# EAGLE design LoRareceiver (EAGLE 9.6.2)
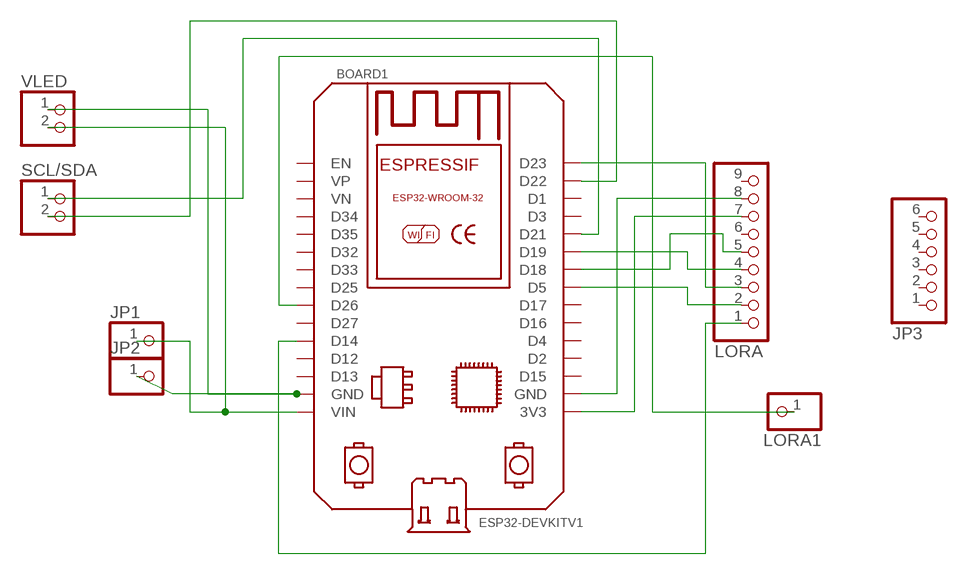
[diagram p0: schematic, sheet 1]

## Parts
BOARD1  ESP32DEVKITV1  [ESP32-DEVKITV1]
JP1  PINHD-1X1  [1X01]
JP2  PINHD-1X1  [1X01]
JP3  PINHD-1X6  [1X06]
LORA  PINHD-1X9  [1X09-BIG]
LORA1  PINHD-1X1  [1X01]
SCL/SDA  PINHD-1X2  [1X02]
VLED  PINHD-1X2  [1X02]

## Nets
N$1: BOARD1.D14 LORA.1
N$2: BOARD1.D5 LORA.2
N$3: BOARD1.D23 LORA.3
N$4: BOARD1.D19 LORA.4
N$5: BOARD1.D18 LORA.5
N$6: BOARD1.D26 LORA1.1
N$7: BOARD1.3V3 LORA.7
N$8: BOARD1.GND@1(GND) LORA.8
N$9: BOARD1.VIN JP1.1 VLED.2
N$10: BOARD1.GND JP2.1 VLED.1
N$12: BOARD1.D22 SCL/SDA.2
N$13: BOARD1.D21 SCL/SDA.1
Unconnected: BOARD1.D1 BOARD1.D2 BOARD1.D3 BOARD1.D4 BOARD1.D12 BOARD1.D13 BOARD1.D15 BOARD1.D16 BOARD1.D17 BOARD1.D25 BOARD1.D27 BOARD1.D32 BOARD1.D33 BOARD1.D34 BOARD1.D35 BOARD1.EN BOARD1.VN BOARD1.VP JP3.1 JP3.2 JP3.3 JP3.4 JP3.5 JP3.6 LORA.6 LORA.9

## Library data of the parts
BOARD1 = ESP32-DEVKITV1:ESP32DEVKITV1: https://github.com/shridattdudhat
JP1 JP2 LORA1 = adafruit:PINHD-1X1: Pin header 1x1 for 0.1" spacing With round pins
JP3 = adafruit:PINHD-1X6: PIN HEADER
LORA = adafruit:PINHD-1X9: Pin header 1x10 0.1" spacing With round pins
SCL/SDA VLED = pinhead:PINHD-1X2: PIN HEADER

## Board
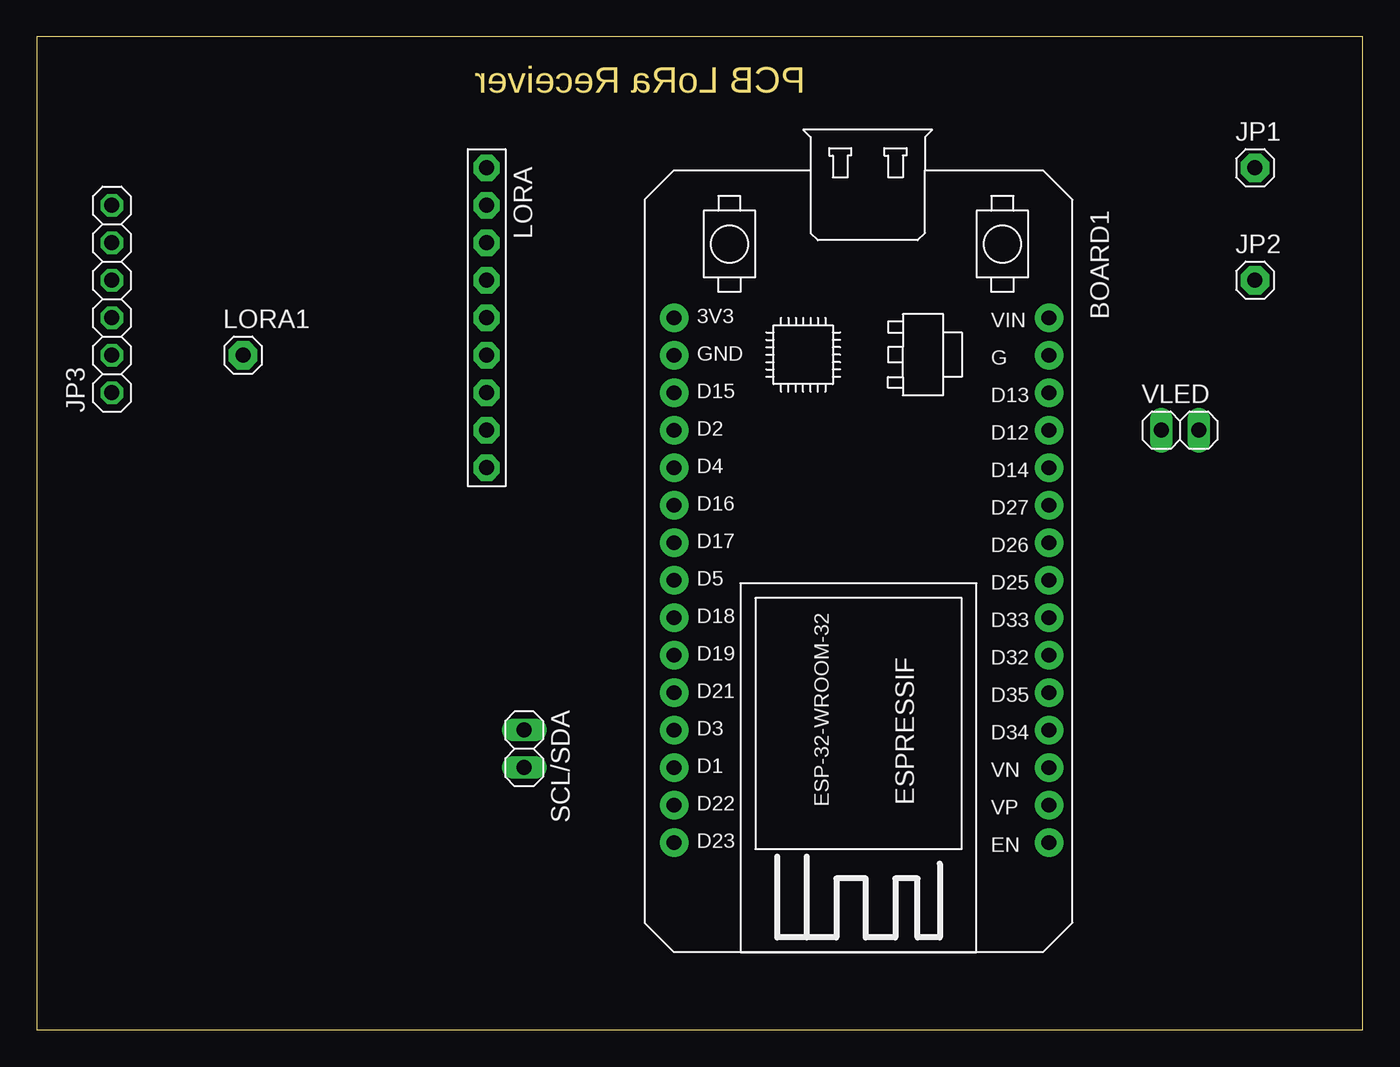
[diagram p1: board, top side]
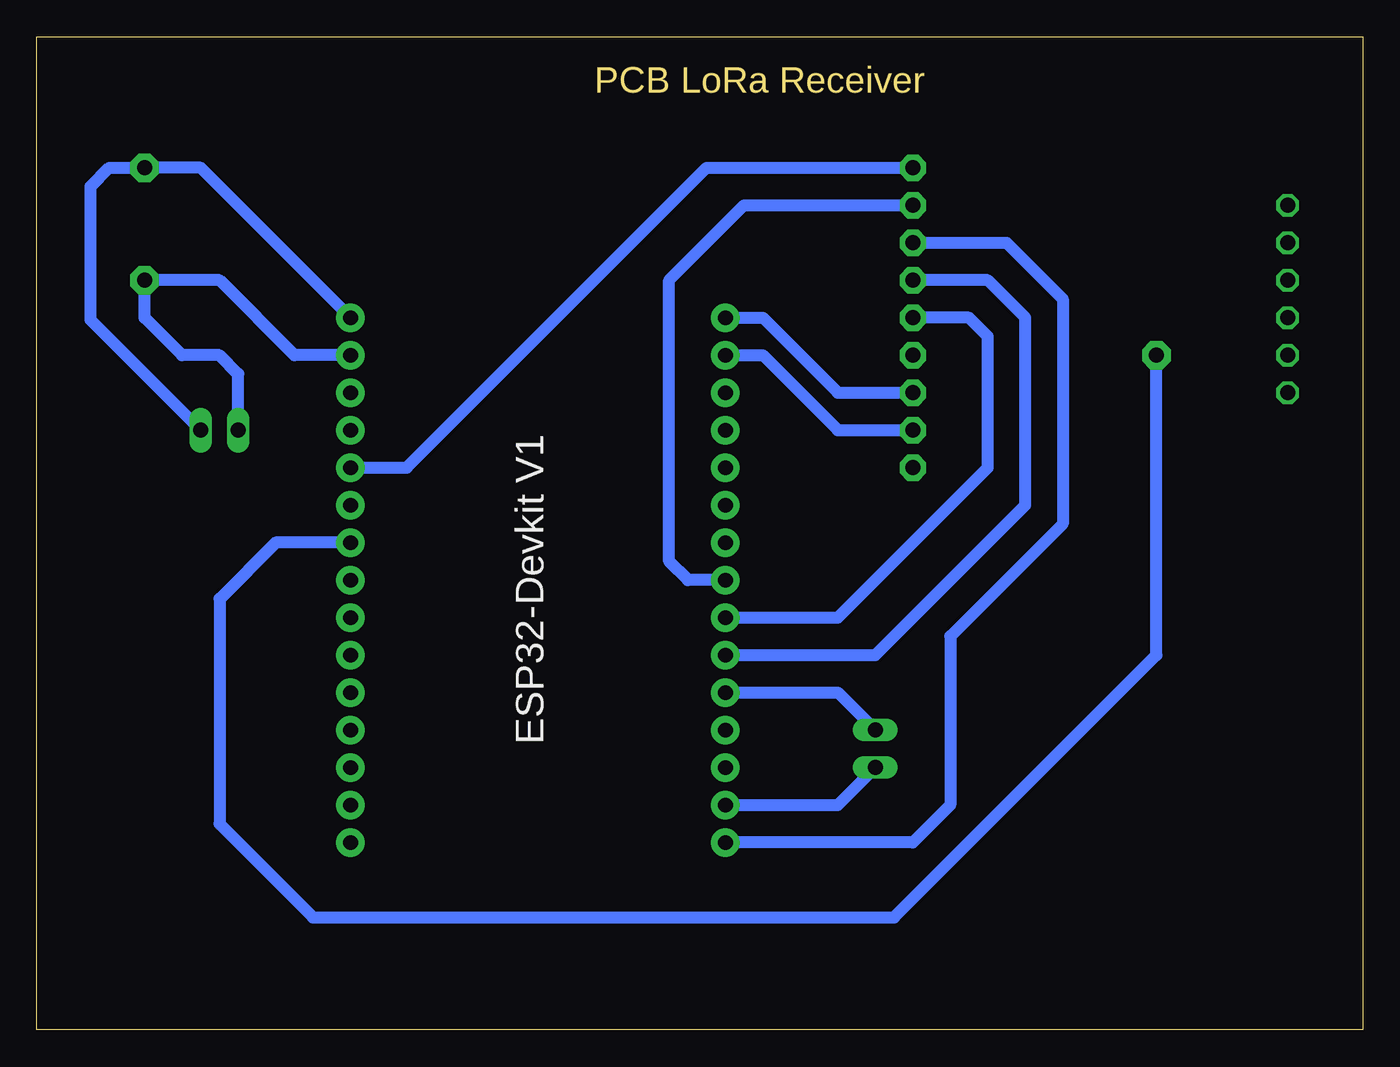
[diagram p2: board, bottom side, seen from below]

Size 89.84 x 67.3 mm. Coordinates in mm from the lower left corner, seen from the top.
Outline: 0,0 89.84,0 89.84,67.3 0,67.3 0,0
Copper layers (1*16): Top 0.035mm / dielectric 1.5mm / Bottom 0.035mm
Design rules "default": minimum track width 6mil, minimum drill 0.35mm, track to track 6mil, track to pad 6mil, pad to pad 6mil, via to via 6mil, smd to smd 6mil, copper to edge 40mil, drill to drill 6mil, minimum pad ring 10mil, minimum via ring 8mil, stop-mask expansion 4mil, vias tented up to drill 0mil, thermal gap 10mil

### Footprints (pad centres in the part's own frame; a part is rotated, then mirrored left to right if it is on the bottom)
ESP32-DEVKITV1 = drill 1 pad 1.93: 3V3 0,0; D1 30.48,0; D2 7.62,0; D3 27.94,0; D4 10.16,0; D5 17.78,0; D12 7.62,25.4; D13 5.08,25.4; D14 10.16,25.4; D15 5.08,0; D16 12.7,0; D17 15.24,0; D18 20.32,0; D19 22.86,0; D21 25.4,0; D22 33.02,0; D23 35.56,0; D25 17.78,25.4; D26 15.24,25.4; D27 12.7,25.4; D32 22.86,25.4; D33 20.32,25.4; D34 27.94,25.4; D35 25.4,25.4; EN 35.56,25.4; GND 2.54,25.4; GND@1 2.54,0; VIN 0,25.4; VN 30.48,25.4; VP 33.02,25.4
1X01 = drill 1.016 pad 1.93 octagon: 1 0,0
1X06 = drill 1.016 octagon: 1 -6.35,0; 2 -3.81,0; 3 -1.27,0; 4 1.27,0; 5 3.81,0; 6 6.35,0
1X09-BIG = drill 1.016 pad 1.778 octagon: 1 -10.16,0; 2 -7.62,0; 3 -5.08,0; 4 -2.54,0; 5 0,0; 6 2.54,0; 7 5.08,0; 8 7.62,0; 9 10.16,0
1X02 = drill 1.016 long: 1 -1.27,0; 2 1.27,0

### Placement (x,y rotation side)
BOARD1  43.18,48.26 270 top
JP1  82.55,58.42 0 top
JP2  82.55,50.8 0 top
JP3  5.08,49.53 90 top
LORA  30.48,48.26 270 top
LORA1  13.97,45.72 0 top
SCL/SDA  33.02,19.05 270 top
VLED  77.47,40.64 0 top

### Tracks (layer width: path | path; a pad name or v marks a point on that pad's centre or on a via)
N$1
  Bottom 0.813: BOARD1.D14 64.77,38.1 44.45,58.42 LORA.1
N$2
  Bottom 0.813: BOARD1.D5 45.72,30.48 46.99,31.75 46.99,50.8 41.91,55.88 LORA.2
N$3
  Bottom 0.813: BOARD1.D23 30.48,12.7 27.94,15.24 27.94,26.67 20.32,34.29 20.32,49.53 24.13,53.34 LORA.3
N$4
  Bottom 0.813: BOARD1.D19 33.02,25.4 22.86,35.56 22.86,48.26 25.4,50.8 LORA.4
N$5
  Bottom 0.813: LORA.5 26.67,48.26 25.4,46.99 25.4,38.1 35.56,27.94 BOARD1.D18
N$6
  Bottom 0.813: BOARD1.D26 73.66,33.02 77.47,29.21 77.47,13.97 71.12,7.62 31.75,7.62 13.97,25.4 LORA1.1
N$7
  Bottom 0.813: LORA.7 35.56,43.18 40.64,48.26 BOARD1.3V3
N$8
  Bottom 0.813: BOARD1.GND@1 40.64,45.72 35.56,40.64 LORA.8
N$9
  Bottom 0.813: BOARD1.VIN 78.74,58.42 JP1.1 84.94,58.42 86.21,57.15 86.21,48.11 VLED.2
N$10
  Bottom 0.813: BOARD1.GND 72.39,45.72 77.47,50.8 JP2.1 82.55,48.26 80.01,45.72 77.47,45.72 76.2,44.45 VLED.1
N$12
  Bottom 0.813: BOARD1.D22 35.56,15.24 SCL/SDA.2
N$13
  Bottom 0.813: BOARD1.D21 35.56,22.86 SCL/SDA.1

### Text on the board
Dimension: PCB LoRa Receiver